# Altium schematic sheet 1-Main.SchDoc
size 594 x 420 mm; SheetNumber: 1; SheetTotal: 7; Organization: Altium Limited; Address1: L3, 12a Rodborough Rd; Address2: Frenchs Forest; Address3: NSW; Address4: Australia 2086; PageSetup: Record=PageOptions|CenterHorizontal=True|CenterVertical=True|PrintScale=0.98|XCorrection=1.00|YCorrection=1.00|PrintKind=0|BorderSize=5000000|LeftOffset=0|BottomOffset=0|Orientation=2|PaperLength=1000|PaperWidth=1000|Scale=100|PaperSource=7|PrintQuality=-3|MediaType=1|DitherType=10|PrintScaleMode=1|PaperKind=A3|PaperIndex=8; NumTotalFolhas: 7; NumFolha: 1
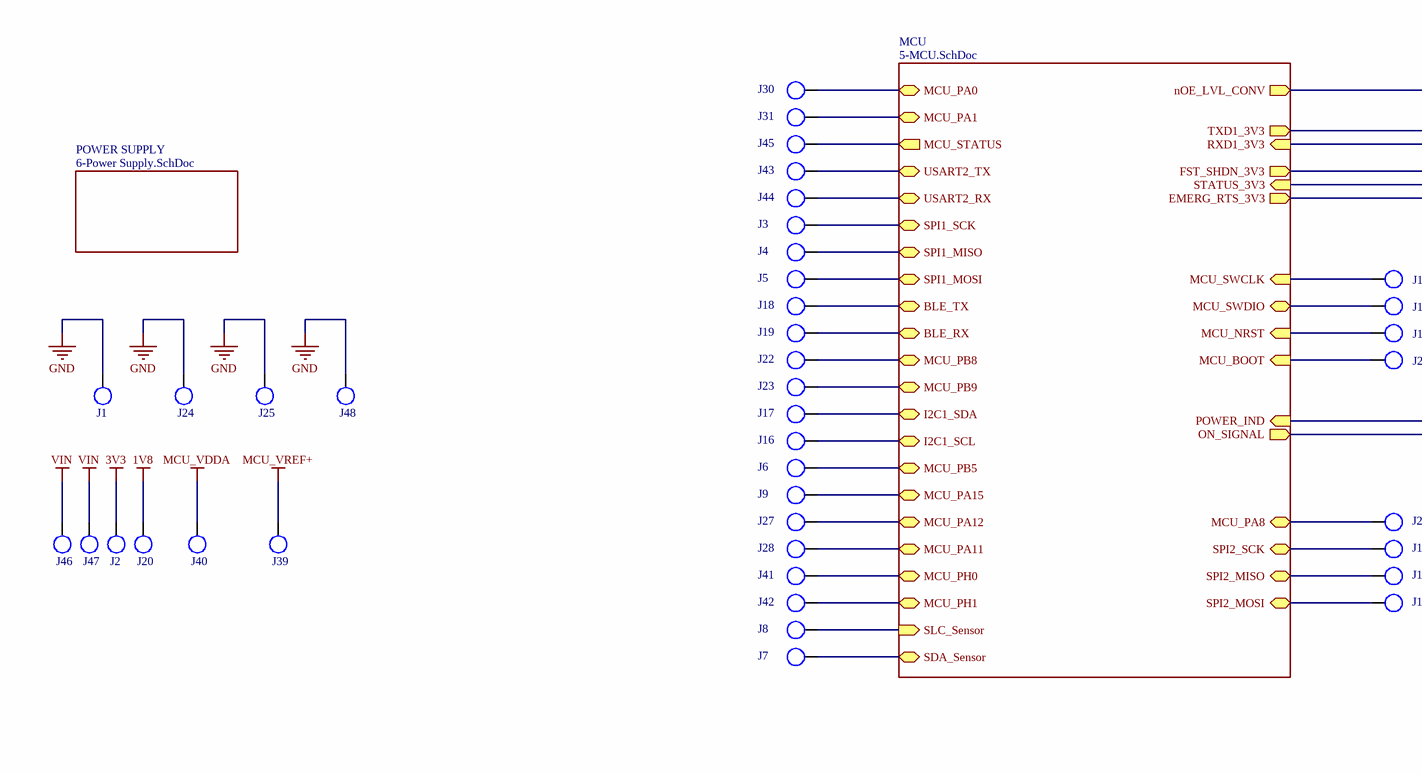
[diagram p0: 1-Main.SchDoc, left]
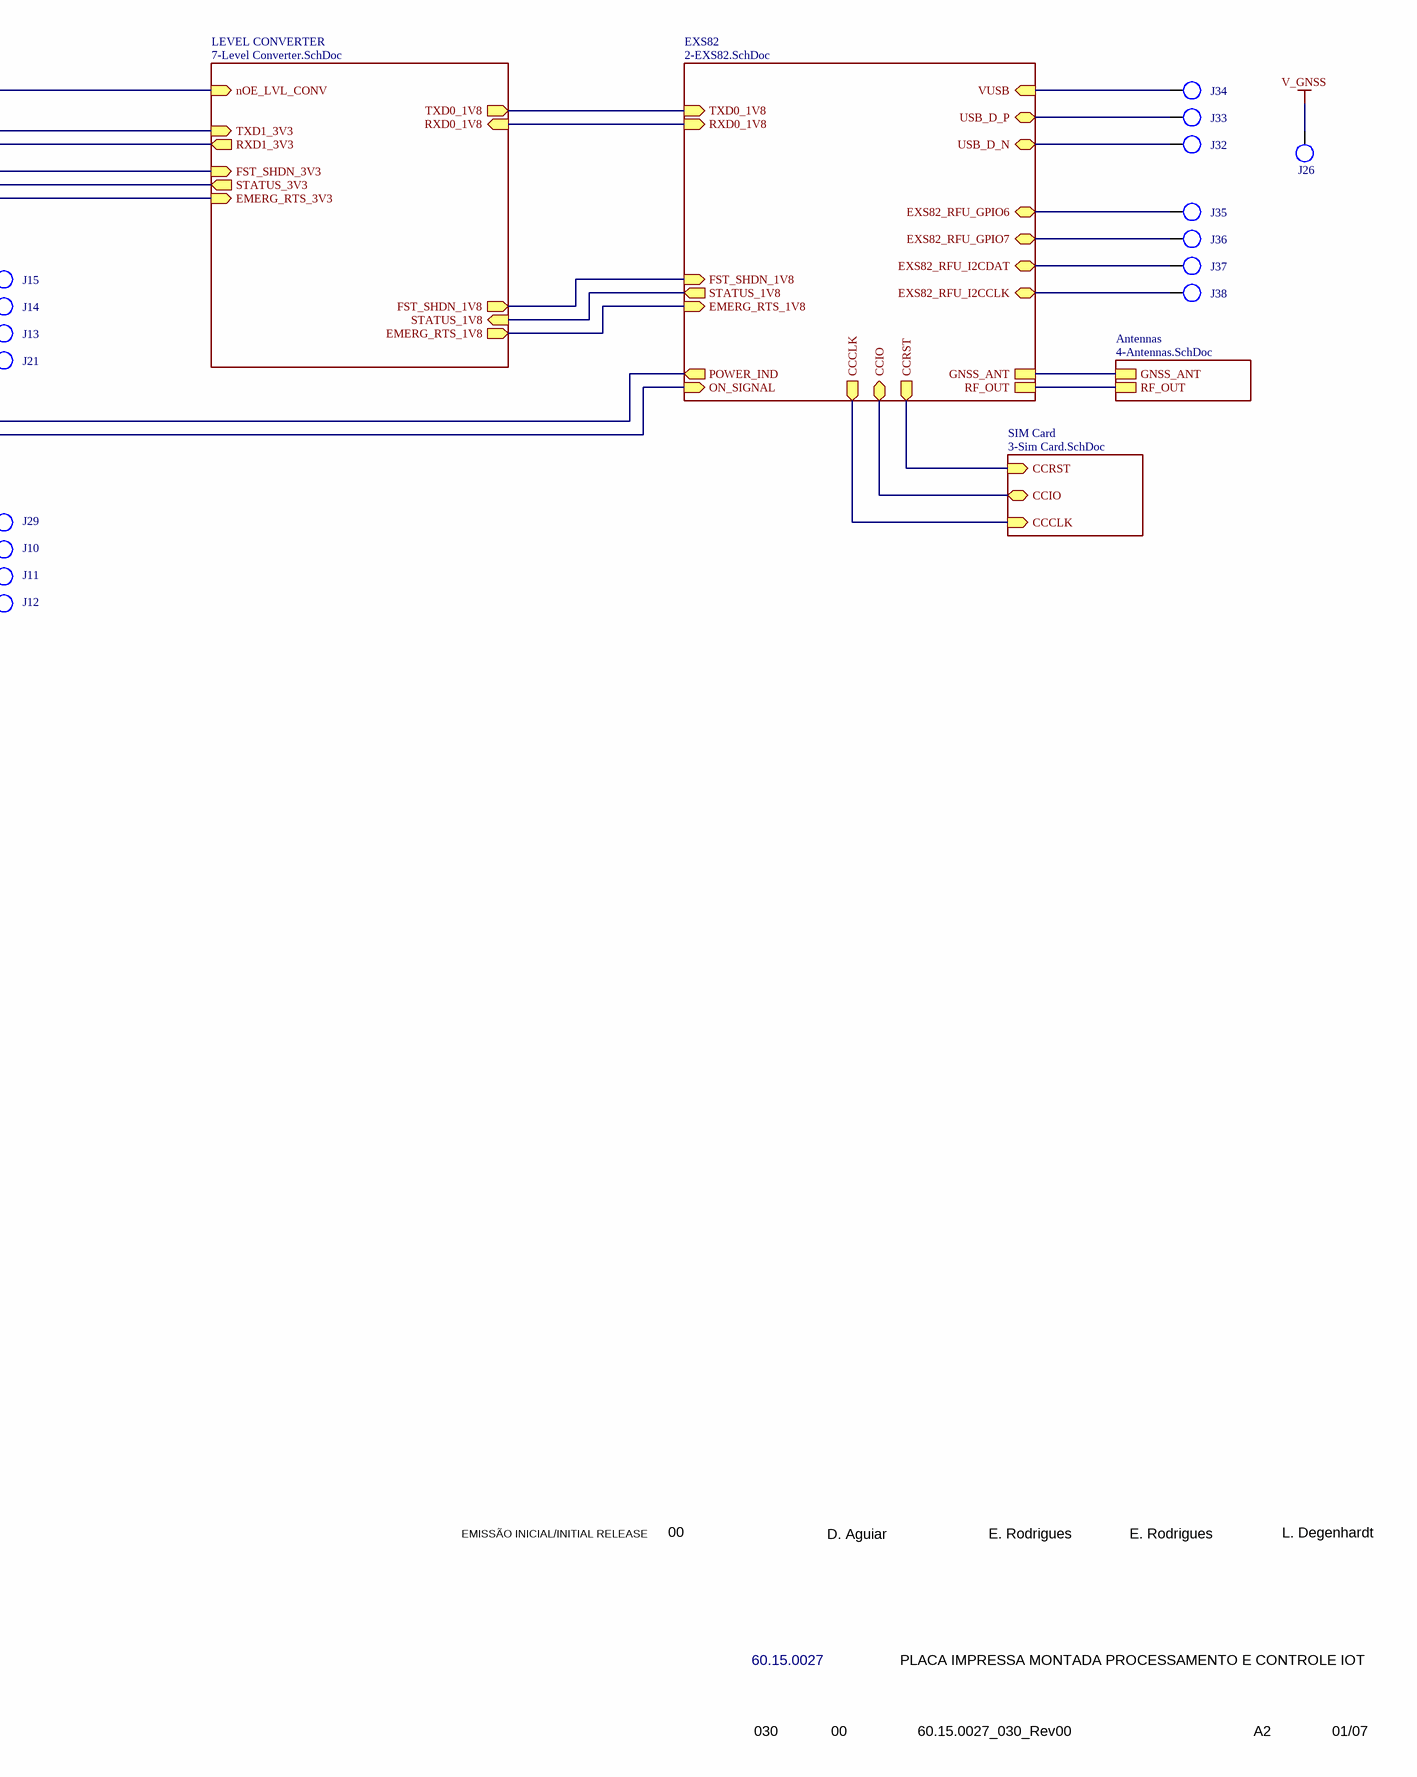
[diagram p1: 1-Main.SchDoc, right]

## Parts
J1  CASTELATION  [CASTELATION]  (value not drawn)
J2  CASTELATION  [CASTELATION]  (value not drawn)
J3  CASTELATION  [CASTELATION]  (value not drawn)
J4  CASTELATION  [CASTELATION]  (value not drawn)
J5  CASTELATION  [CASTELATION]  (value not drawn)
J6  CASTELATION  [CASTELATION]  (value not drawn)
J7  CASTELATION  [CASTELATION]  (value not drawn)
J8  CASTELATION  [CASTELATION]  (value not drawn)
J9  CASTELATION  [CASTELATION]  (value not drawn)
J10  CASTELATION  [CASTELATION]  (value not drawn)
J11  CASTELATION  [CASTELATION]  (value not drawn)
J12  CASTELATION  [CASTELATION]  (value not drawn)
J13  CASTELATION  [CASTELATION]  (value not drawn)
J14  CASTELATION  [CASTELATION]  (value not drawn)
J15  CASTELATION  [CASTELATION]  (value not drawn)
J16  CASTELATION  [CASTELATION]  (value not drawn)
J17  CASTELATION  [CASTELATION]  (value not drawn)
J18  CASTELATION  [CASTELATION]  (value not drawn)
J19  CASTELATION  [CASTELATION]  (value not drawn)
J20  CASTELATION  [CASTELATION]  (value not drawn)
J21  CASTELATION  [CASTELATION]  (value not drawn)
J22  CASTELATION  [CASTELATION]  (value not drawn)
J23  CASTELATION  [CASTELATION]  (value not drawn)
J24  CASTELATION  [CASTELATION]  (value not drawn)
J25  CASTELATION  [CASTELATION]  (value not drawn)
J26  CASTELATION  [CASTELATION]  (value not drawn)
J27  CASTELATION  [CASTELATION]  (value not drawn)
J28  CASTELATION  [CASTELATION]  (value not drawn)
J29  CASTELATION  [CASTELATION]  (value not drawn)
J30  CASTELATION  [CASTELATION]  (value not drawn)
J31  CASTELATION  [CASTELATION]  (value not drawn)
J32  CASTELATION  [CASTELATION]  (value not drawn)
J33  CASTELATION  [CASTELATION]  (value not drawn)
J34  CASTELATION  [CASTELATION]  (value not drawn)
J35  CASTELATION  [CASTELATION]  (value not drawn)
J36  CASTELATION  [CASTELATION]  (value not drawn)
J37  CASTELATION  [CASTELATION]  (value not drawn)
J38  CASTELATION  [CASTELATION]  (value not drawn)
J39  CASTELATION  [CASTELATION]  (value not drawn)
J40  CASTELATION  [CASTELATION]  (value not drawn)
J41  CASTELATION  [CASTELATION]  (value not drawn)
J42  CASTELATION  [CASTELATION]  (value not drawn)
J43  CASTELATION  [CASTELATION]  (value not drawn)
J44  CASTELATION  [CASTELATION]  (value not drawn)
J45  CASTELATION  [CASTELATION]  (value not drawn)
J46  CASTELATION  [CASTELATION]  (value not drawn)
J47  CASTELATION  [CASTELATION]  (value not drawn)
J48  CASTELATION  [CASTELATION]  (value not drawn)

## Sub-sheets
Antennas = 4-Antennas.SchDoc: RF_OUT, GNSS_ANT
EXS82 = 2-EXS82.SchDoc: EMERG_RTS_1V8 (in), RXD0_1V8 (in), VUSB (in), USB_D_P (bidir), TXD0_1V8 (in), USB_D_N (bidir), POWER_IND (out), ON_SIGNAL (in), EXS82_RFU_GPIO6 (bidir), EXS82_RFU_GPIO7 (bidir), EXS82_RFU_I2CDAT (bidir), EXS82_RFU_I2CCLK (bidir), FST_SHDN_1V8 (in), STATUS_1V8 (out), GNSS_ANT, RF_OUT, CCRST (out), CCIO (bidir), CCCLK (out)
LEVEL CONVERTER = 7-Level Converter.SchDoc: RXD1_3V3 (out), RXD0_1V8 (in), TXD0_1V8 (out), EMERG_RTS_1V8 (out), TXD1_3V3 (in), EMERG_RTS_3V3 (in), STATUS_1V8 (in), STATUS_3V3 (out), FST_SHDN_3V3 (in), FST_SHDN_1V8 (out), nOE_LVL_CONV (in)
MCU = 5-MCU.SchDoc: RXD1_3V3 (in), TXD1_3V3 (out), EMERG_RTS_3V3 (out), MCU_PH1 (bidir), MCU_PA11 (bidir), MCU_PA12 (bidir), POWER_IND (in), MCU_PB5 (bidir), MCU_PH0 (bidir), ON_SIGNAL (out), I2C1_SDA (bidir), BLE_TX (bidir), MCU_PA15 (bidir), SPI1_MOSI (bidir), MCU_PB8 (bidir), MCU_SWCLK (in), I2C1_SCL (bidir), MCU_SWDIO (bidir), SPI1_MISO (bidir), SPI1_SCK (bidir), MCU_PB9 (bidir), USART2_RX (bidir), BLE_RX (bidir), USART2_TX (bidir), MCU_STATUS (out), MCU_PA0 (bidir), MCU_PA1 (bidir), MCU_NRST (in), STATUS_3V3 (in), FST_SHDN_3V3 (out), nOE_LVL_CONV (out), MCU_BOOT (in), MCU_PA8 (bidir), SPI2_MOSI (bidir), SPI2_MISO (bidir), SPI2_SCK (bidir), SLC_Sensor (in), SDA_Sensor (bidir)
POWER SUPPLY = 6-Power Supply.SchDoc: no entries
SIM Card = 3-Sim Card.SchDoc: CCRST (in), CCCLK (in), CCIO (bidir)

## Nets
1V8: J20.1
3V3: J2.1
GND: J1.1 J24.1 J25.1 J48.1
MCU_VDDA: J40.1
MCU_VREF+: J39.1
V_GNSS: J26.1
VIN: J46.1 J47.1
NetJ3_1: J3.1 ; sheet MCU/SPI1_SCK
NetJ4_1: J4.1 ; sheet MCU/SPI1_MISO
NetJ5_1: J5.1 ; sheet MCU/SPI1_MOSI
NetJ6_1: J6.1 ; sheet MCU/MCU_PB5
NetJ7_1: J7.1 ; sheet MCU/SDA_Sensor
NetJ8_1: J8.1 ; sheet MCU/SLC_Sensor
NetJ9_1: J9.1 ; sheet MCU/MCU_PA15
NetJ10_1: J10.1 ; sheet MCU/SPI2_SCK
NetJ11_1: J11.1 ; sheet MCU/SPI2_MISO
NetJ12_1: J12.1 ; sheet MCU/SPI2_MOSI
NetJ13_1: J13.1 ; sheet MCU/MCU_NRST
NetJ14_1: J14.1 ; sheet MCU/MCU_SWDIO
NetJ15_1: J15.1 ; sheet MCU/MCU_SWCLK
NetJ16_1: J16.1 ; sheet MCU/I2C1_SCL
NetJ17_1: J17.1 ; sheet MCU/I2C1_SDA
NetJ18_1: J18.1 ; sheet MCU/BLE_TX
NetJ19_1: J19.1 ; sheet MCU/BLE_RX
NetJ21_1: J21.1 ; sheet MCU/MCU_BOOT
NetJ22_1: J22.1 ; sheet MCU/MCU_PB8
NetJ23_1: J23.1 ; sheet MCU/MCU_PB9
NetJ27_1: J27.1 ; sheet MCU/MCU_PA12
NetJ28_1: J28.1 ; sheet MCU/MCU_PA11
NetJ29_1: J29.1 ; sheet MCU/MCU_PA8
NetJ30_1: J30.1 ; sheet MCU/MCU_PA0
NetJ31_1: J31.1 ; sheet MCU/MCU_PA1
NetJ32_1: J32.1 ; sheet EXS82/USB_D_N
NetJ33_1: J33.1 ; sheet EXS82/USB_D_P
NetJ34_1: J34.1 ; sheet EXS82/VUSB
NetJ35_1: J35.1 ; sheet EXS82/EXS82_RFU_GPIO6
NetJ36_1: J36.1 ; sheet EXS82/EXS82_RFU_GPIO7
NetJ37_1: J37.1 ; sheet EXS82/EXS82_RFU_I2CDAT
NetJ38_1: J38.1 ; sheet EXS82/EXS82_RFU_I2CCLK
NetJ41_1: J41.1 ; sheet MCU/MCU_PH0
NetJ42_1: J42.1 ; sheet MCU/MCU_PH1
NetJ43_1: J43.1 ; sheet MCU/USART2_TX
NetJ44_1: J44.1 ; sheet MCU/USART2_RX
NetJ45_1: J45.1 ; sheet MCU/MCU_STATUS
(unnamed): sheet MCU/RXD1_3V3, sheet LEVEL CONVERTER/RXD1_3V3
(unnamed): sheet MCU/TXD1_3V3, sheet LEVEL CONVERTER/TXD1_3V3
(unnamed): sheet MCU/EMERG_RTS_3V3, sheet LEVEL CONVERTER/EMERG_RTS_3V3
(unnamed): sheet MCU/POWER_IND, sheet EXS82/POWER_IND
(unnamed): sheet MCU/ON_SIGNAL, sheet EXS82/ON_SIGNAL
(unnamed): sheet MCU/STATUS_3V3, sheet LEVEL CONVERTER/STATUS_3V3
(unnamed): sheet MCU/FST_SHDN_3V3, sheet LEVEL CONVERTER/FST_SHDN_3V3
(unnamed): sheet MCU/nOE_LVL_CONV, sheet LEVEL CONVERTER/nOE_LVL_CONV
(unnamed): sheet LEVEL CONVERTER/RXD0_1V8, sheet EXS82/RXD0_1V8
(unnamed): sheet LEVEL CONVERTER/TXD0_1V8, sheet EXS82/TXD0_1V8
(unnamed): sheet LEVEL CONVERTER/EMERG_RTS_1V8, sheet EXS82/EMERG_RTS_1V8
(unnamed): sheet LEVEL CONVERTER/STATUS_1V8, sheet EXS82/STATUS_1V8
(unnamed): sheet LEVEL CONVERTER/FST_SHDN_1V8, sheet EXS82/FST_SHDN_1V8
(unnamed): sheet EXS82/GNSS_ANT, sheet Antennas/GNSS_ANT
(unnamed): sheet EXS82/RF_OUT, sheet Antennas/RF_OUT
(unnamed): sheet EXS82/CCRST, sheet SIM Card/CCRST
(unnamed): sheet EXS82/CCIO, sheet SIM Card/CCIO
(unnamed): sheet EXS82/CCCLK, sheet SIM Card/CCCLK

## Notes on the sheet
- EMISSÃO INICIAL/INITIAL RELEASE
- 00
- D. Aguiar
- E. Rodrigues
- L. Degenhardt
- 60.15.0027
- PLACA IMPRESSA MONTADA PROCESSAMENTO E CONTROLE IOT
- 030
- 60.15.0027_030_Rev00
- A2
- 01/07
- 1
- 2
- 3
- 4
- 5
- 6
- 7
- 8
- A
- B
- C
- D
- E
- F
- G
- H
- HISTORICO DA REV / EVOLUTION
- REV
- DATA / DATE
- DOCUMENTO DE ENGENHARIA DE PRODUTO
- ELABORADO / DRAWN
- DOCUMENT OF PRODUCT ENGINEERING
- VERIFICADO / CHECKED
- APROVADO / APPROVED
- QUALIDADE / QUALITY
- CÓDIGO / CODE
- DESCRIÇÃO / DESCRIPTION
- DOC
- ARQUIVO / FILE
- FORM./SIZE
- FOLHA / PAGE